# Altium schematic sheet Signal_isolator.SchDoc: Signal_isolator
size A4; Author: Luís; Organization: UNICAMP / LCEE; Address1: University of Campinas - Brazil; Address2: Power Conditioning Laboratory; Address3: Licensed by GNU GPL 3.0; ProjectName: Easy Inverter
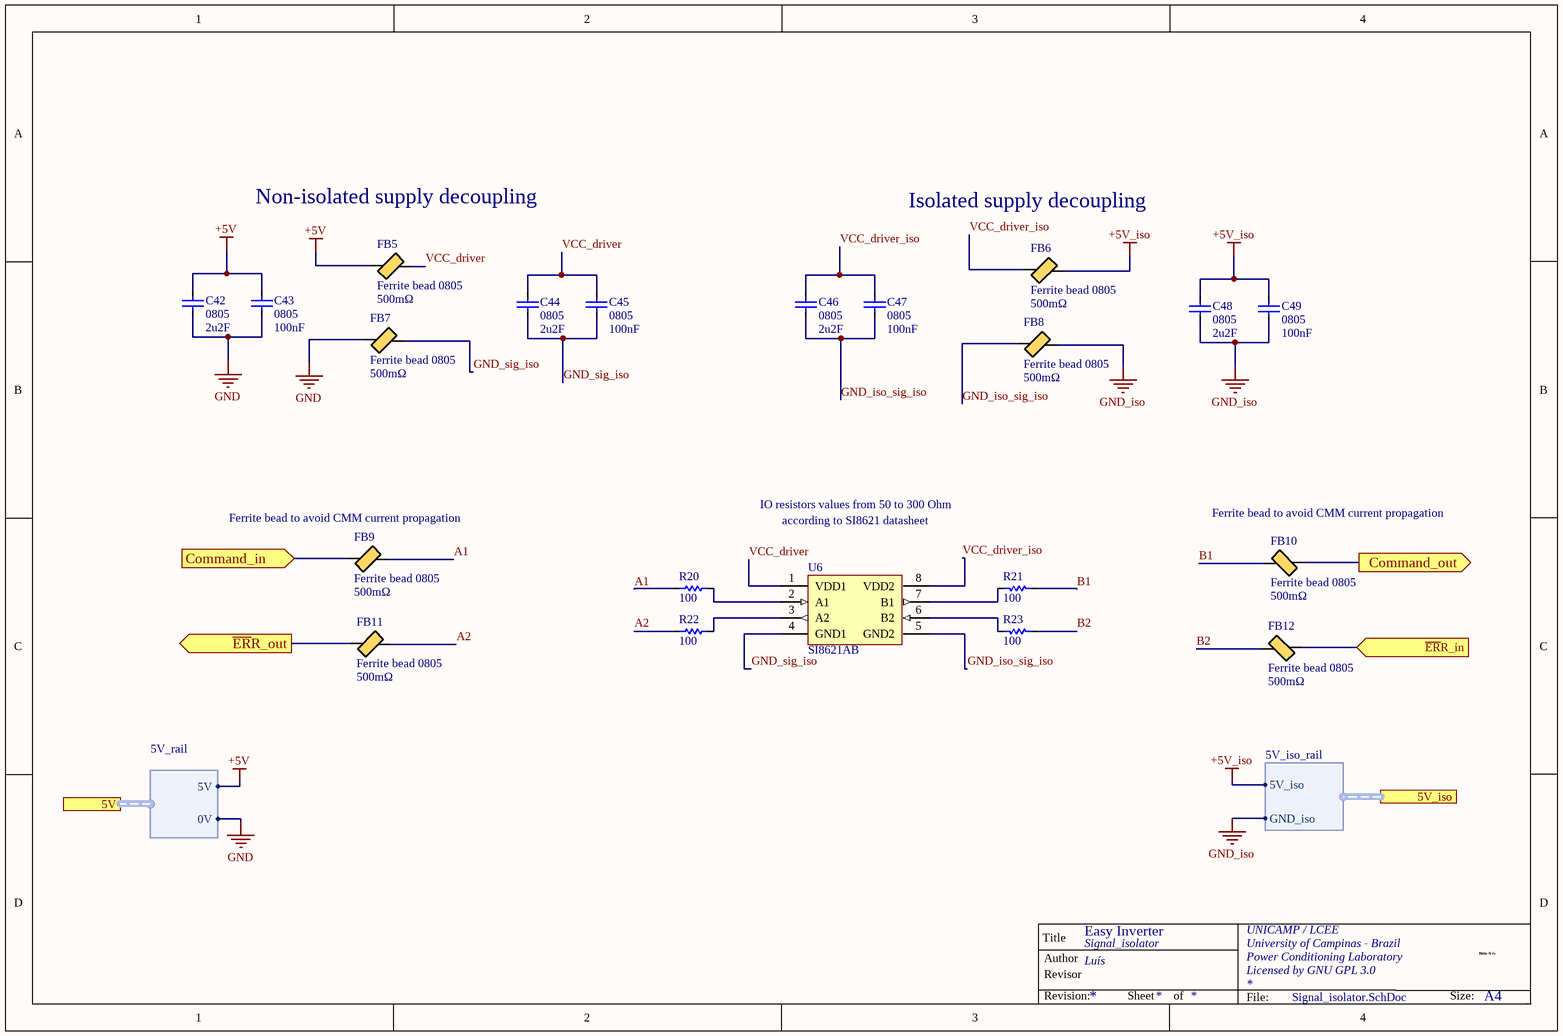
[diagram p0: Signal_isolator.SchDoc]

## Parts
C42  0805  value 2u2F  [Capacitor 0805]
C43  0805  value 100nF  [Capacitor 0805]
C44  0805  value 2u2F  [Capacitor 0805]
C45  0805  value 100nF  [Capacitor 0805]
C46  0805  value 2u2F  [Capacitor 0805]
C47  0805  value 100nF  [Capacitor 0805]
C48  0805  value 2u2F  [Capacitor 0805]
C49  0805  value 100nF  [Capacitor 0805]
FB5  Ferrite bead 0805  DC resistance: 500mΩ  [Bead 0805]
FB6  Ferrite bead 0805  DC resistance: 500mΩ  [Bead 0805]
FB7  Ferrite bead 0805  DC resistance: 500mΩ  [Bead 0805]
FB8  Ferrite bead 0805  DC resistance: 500mΩ  [Bead 0805]
FB9  Ferrite bead 0805  DC resistance: 500mΩ  [Bead 0805]
FB10  Ferrite bead 0805  DC resistance: 500mΩ  [Bead 0805]
FB11  Ferrite bead 0805  DC resistance: 500mΩ  [Bead 0805]
FB12  Ferrite bead 0805  DC resistance: 500mΩ  [Bead 0805]
R20  value 100  [Resistor 0805]  (hidden comment: Resistor 0805)
R21  value 100  [Resistor 0805]  (hidden comment: Resistor 0805)
R22  value 100  [Resistor 0805]  (hidden comment: Resistor 0805)
R23  value 100  [Resistor 0805]  (hidden comment: Resistor 0805)
U6  SI8621AB  [SOIC 8]

## Ports
5V (harness 5V_rail), 5V_iso (harness 5V_iso_rail), Command_in (in), Command_out (out), ~{ER}R_in (in), ~{ER}R_out (out)

## Harnesses
5V_rail: 0V, 5V
5V_iso_rail: GND_iso, 5V_iso

## Nets
+5V: C42.1 C43.1 FB5.1 ; port 5V.5V
+5V_iso: C48.1 C49.1 FB6.2 ; port 5V_iso.5V_iso
GND: C42.2 C43.2 FB7.1 ; port 5V.0V
GND_iso: C48.2 C49.2 FB8.2 ; port 5V_iso.GND_iso
~{ER}R_in: FB12.1 ; port ~{ER}R_in
~{ER}R_out: FB11.1 ; port ~{ER}R_out
A1: FB9.2 R20.1
A2: FB11.2 R22.1
B1: FB10.2 R21.1
B2: FB12.2 R23.1
Command_in: FB9.1 ; port Command_in
Command_out: FB10.1 ; port Command_out
GND_iso_sig_iso: C46.2 C47.2 FB8.1 U6.5(GND2)
GND_sig_iso: C44.2 C45.2 FB7.2 U6.4(GND1)
VCC_driver: C44.1 C45.1 FB5.2 U6.1(VDD1)
VCC_driver_iso: C46.1 C47.1 FB6.1 U6.8(VDD2)
NetR20_2: R20.2 U6.2(A1)
NetR21_2: R21.2 U6.7(B1)
NetR22_2: R22.2 U6.3(A2)
NetR23_2: R23.2 U6.6(B2)

## Notes on the sheet
- Non-isolated supply decoupling
- Isolated supply decoupling
- IO resistors values from 50 to 300 Ohm
- (near FB10) Ferrite bead to avoid CMM current propagation
- (near FB9) Ferrite bead to avoid CMM current propagation
- according to SI8621 datasheet
- Title
- Author
- Revisor
- Hildo G Jr
- Revision:
- Sheet
- of
- File:
- Size:
- A4
- HGJr

## Library data of the parts
C42-C49 = Capacitor 0805: SMD ceramic capacitor 0805; pn: undefined
  C44 C46: ClassName: Direct_plane_connect
FB5-FB12 = Ferrite_bead: Ferrite bead chip 0805; pn: CIM21J252NE; 782853152; 742792097; MMZ2012Y202BT000; CIC21J601NE;  MI0805J102R-10; CIM21J202NE;; Value: Resistance @ Frequency; ComponentLink1Description: CIM21J252NE; ComponentLink1URL: http://www.samsungsem.com/kr/support/product-search/bead/__icsFiles/afieldfile/2014/11/13/S_CIM21J252NE.pdf; ComponentLink2Description: 782853152; ComponentLink2URL: http://katalog.we-online.de/pbs/datasheet/782853152.pdf; ComponentLink3Description: 742792097; ComponentLink3URL: http://katalog.we-online.de/pbs/datasheet/742792097.pdf; ComponentLink4Description: MMZ2012Y202BT000; ComponentLink4URL: https://product.tdk.com/info/en/catalog/datasheets/beads_commercial_signal_mmz2012_en.pdf; ComponentLink5Description: CIC21J601NE; ComponentLink5URL: http://www.samsungsem.com/kr/support/product-search/bead/__icsFiles/afieldfile/2014/11/13/S_CIC21J601NE.pdf; ComponentLink6Description: MI0805J102R-10; ComponentLink6URL: https://assets.lairdtech.com/home/brandworld/files/MI0805J102R-10.pdf; ComponentLink7Description: CIM21J202NE; ComponentLink7URL: http://www.samsungsem.com/kr/support/product-search/bead/__icsFiles/afieldfile/2014/11/13/S_CIM21J202NE.pdf
  FB7 FB8: ClassName: Direct_plane_connect
R20-R23 = Resistor 0805: SMD resistor 0805; pn: undefined
U6 = SI8621AB: Digital Isolator 2.5KV, general purpose 8SOIC; pn: SI8621AB-B-IS; ComponentLink1Description: Datasheet; ComponentLink1URL: https://media.digikey.com/pdf/Data%20Sheets/Silicon%20Laboratories%20PDFs/Si8410_20_21_Rev_1.5.pdf; Value: SI8621AB